# Altium schematic sheet DIY-USB Led Controller.SchDoc
size A; DocumentNumber: 1; SheetNumber: 1; SheetTotal: 7
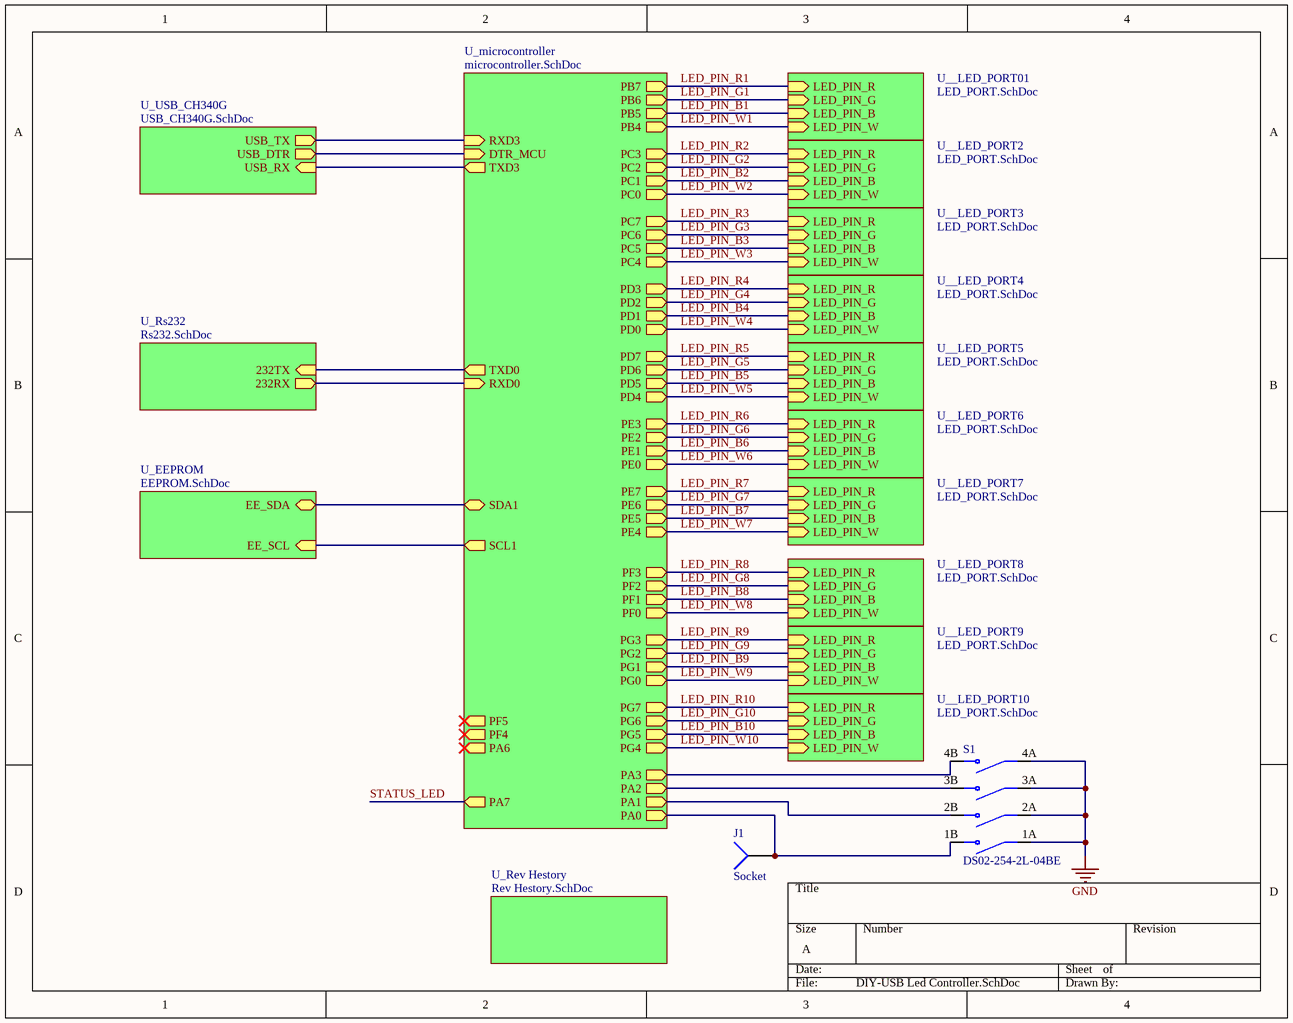
[diagram p0: DIY-USB Led Controller.SchDoc]

## Parts
J1  Socket  [PIN1]
S1  DS02-254-2L-04BE  [SW_DS02-254-2L-04BE]

## Sub-sheets
U__LED_PORT01 = LED_PORT.SchDoc: LED_PIN_R (in), LED_PIN_B (in), LED_PIN_W (in), LED_PIN_G (in)
U__LED_PORT2 = LED_PORT.SchDoc: LED_PIN_R (in), LED_PIN_B (in), LED_PIN_W (in), LED_PIN_G (in)
U__LED_PORT3 = LED_PORT.SchDoc: LED_PIN_R (in), LED_PIN_B (in), LED_PIN_W (in), LED_PIN_G (in)
U__LED_PORT4 = LED_PORT.SchDoc: LED_PIN_R (in), LED_PIN_B (in), LED_PIN_W (in), LED_PIN_G (in)
U__LED_PORT5 = LED_PORT.SchDoc: LED_PIN_R (in), LED_PIN_B (in), LED_PIN_W (in), LED_PIN_G (in)
U__LED_PORT6 = LED_PORT.SchDoc: LED_PIN_R (in), LED_PIN_B (in), LED_PIN_W (in), LED_PIN_G (in)
U__LED_PORT7 = LED_PORT.SchDoc: LED_PIN_R (in), LED_PIN_B (in), LED_PIN_W (in), LED_PIN_G (in)
U__LED_PORT8 = LED_PORT.SchDoc: LED_PIN_R (in), LED_PIN_B (in), LED_PIN_W (in), LED_PIN_G (in)
U__LED_PORT9 = LED_PORT.SchDoc: LED_PIN_R (in), LED_PIN_B (in), LED_PIN_W (in), LED_PIN_G (in)
U__LED_PORT10 = LED_PORT.SchDoc: LED_PIN_R (in), LED_PIN_B (in), LED_PIN_W (in), LED_PIN_G (in)
U_EEPROM = EEPROM.SchDoc: EE_SCL (in), EE_SDA (bidir)
U_microcontroller = microcontroller.SchDoc: PC0 (out), PC1 (out), PC2 (out), PC3 (out), PC4 (out), PC5 (out), PC6 (out), PC7 (out), PE0 (out), PE1 (out), PE2 (out), PE3 (out), PE4 (out), PE5 (out), PE6 (out), PE7 (out), PG0 (out), PG1 (out), PG2 (out), PG3 (out), PG4 (out), PG5 (out), PG6 (out), PG7 (out), PB7 (out), PB6 (out), PB5 (out), PB4 (out), SCL1 (out), SDA1 (bidir), RXD3 (in), TXD3 (out), PD7 (out), PD6 (out), PD5 (out), PD4 (out), PD3 (out), PD2 (out), PD1 (out), PD0 (out), TXD0 (out), RXD0 (in), DTR_MCU (in), PF5 (out), PF4 (out), PF3 (out), PF2 (out), PF1 (out), PF0 (out), PA1 (out), PA3 (out), PA2 (out), PA0 (out), PA7 (out), PA6 (out)
U_Rev Hestory = Rev Hestory.SchDoc: no entries
U_Rs232 = Rs232.SchDoc: 232TX (in), 232RX (out)
U_USB_CH340G = USB_CH340G.SchDoc: USB_TX (out), USB_RX (in), USB_DTR (out)

## Nets
GND: S1.1A(COM1) S1.2A(COM2) S1.3A(COM3) S1.4A(COM4)
LED_PIN_B1: sheet U_microcontroller/PB5, sheet U__LED_PORT01/LED_PIN_B
LED_PIN_B2: sheet U_microcontroller/PC1, sheet U__LED_PORT2/LED_PIN_B
LED_PIN_B3: sheet U_microcontroller/PC5, sheet U__LED_PORT3/LED_PIN_B
LED_PIN_B4: sheet U_microcontroller/PD1, sheet U__LED_PORT4/LED_PIN_B
LED_PIN_B5: sheet U_microcontroller/PD5, sheet U__LED_PORT5/LED_PIN_B
LED_PIN_B6: sheet U_microcontroller/PE1, sheet U__LED_PORT6/LED_PIN_B
LED_PIN_B7: sheet U_microcontroller/PE5, sheet U__LED_PORT7/LED_PIN_B
LED_PIN_B8: sheet U_microcontroller/PF1, sheet U__LED_PORT8/LED_PIN_B
LED_PIN_B9: sheet U_microcontroller/PG1, sheet U__LED_PORT9/LED_PIN_B
LED_PIN_B10: sheet U_microcontroller/PG5, sheet U__LED_PORT10/LED_PIN_B
LED_PIN_G1: sheet U_microcontroller/PB6, sheet U__LED_PORT01/LED_PIN_G
LED_PIN_G2: sheet U_microcontroller/PC2, sheet U__LED_PORT2/LED_PIN_G
LED_PIN_G3: sheet U_microcontroller/PC6, sheet U__LED_PORT3/LED_PIN_G
LED_PIN_G4: sheet U_microcontroller/PD2, sheet U__LED_PORT4/LED_PIN_G
LED_PIN_G5: sheet U_microcontroller/PD6, sheet U__LED_PORT5/LED_PIN_G
LED_PIN_G6: sheet U_microcontroller/PE2, sheet U__LED_PORT6/LED_PIN_G
LED_PIN_G7: sheet U_microcontroller/PE6, sheet U__LED_PORT7/LED_PIN_G
LED_PIN_G8: sheet U_microcontroller/PF2, sheet U__LED_PORT8/LED_PIN_G
LED_PIN_G9: sheet U_microcontroller/PG2, sheet U__LED_PORT9/LED_PIN_G
LED_PIN_G10: sheet U_microcontroller/PG6, sheet U__LED_PORT10/LED_PIN_G
LED_PIN_R1: sheet U_microcontroller/PB7, sheet U__LED_PORT01/LED_PIN_R
LED_PIN_R2: sheet U_microcontroller/PC3, sheet U__LED_PORT2/LED_PIN_R
LED_PIN_R3: sheet U_microcontroller/PC7, sheet U__LED_PORT3/LED_PIN_R
LED_PIN_R4: sheet U_microcontroller/PD3, sheet U__LED_PORT4/LED_PIN_R
LED_PIN_R5: sheet U_microcontroller/PD7, sheet U__LED_PORT5/LED_PIN_R
LED_PIN_R6: sheet U_microcontroller/PE3, sheet U__LED_PORT6/LED_PIN_R
LED_PIN_R7: sheet U_microcontroller/PE7, sheet U__LED_PORT7/LED_PIN_R
LED_PIN_R8: sheet U_microcontroller/PF3, sheet U__LED_PORT8/LED_PIN_R
LED_PIN_R9: sheet U_microcontroller/PG3, sheet U__LED_PORT9/LED_PIN_R
LED_PIN_R10: sheet U_microcontroller/PG7, sheet U__LED_PORT10/LED_PIN_R
LED_PIN_W1: sheet U_microcontroller/PB4, sheet U__LED_PORT01/LED_PIN_W
LED_PIN_W2: sheet U_microcontroller/PC0, sheet U__LED_PORT2/LED_PIN_W
LED_PIN_W3: sheet U_microcontroller/PC4, sheet U__LED_PORT3/LED_PIN_W
LED_PIN_W4: sheet U_microcontroller/PD0, sheet U__LED_PORT4/LED_PIN_W
LED_PIN_W5: sheet U_microcontroller/PD4, sheet U__LED_PORT5/LED_PIN_W
LED_PIN_W6: sheet U_microcontroller/PE0, sheet U__LED_PORT6/LED_PIN_W
LED_PIN_W7: sheet U_microcontroller/PE4, sheet U__LED_PORT7/LED_PIN_W
LED_PIN_W8: sheet U_microcontroller/PF0, sheet U__LED_PORT8/LED_PIN_W
LED_PIN_W9: sheet U_microcontroller/PG0, sheet U__LED_PORT9/LED_PIN_W
LED_PIN_W10: sheet U_microcontroller/PG4, sheet U__LED_PORT10/LED_PIN_W
STATUS_LED: sheet U_microcontroller/PA7
NetJ1_1: J1.1 S1.1B(NO1) ; sheet U_microcontroller/PA0
NetS1_2B: S1.2B(NO2) ; sheet U_microcontroller/PA1
NetS1_3B: S1.3B(NO3) ; sheet U_microcontroller/PA2
NetS1_4B: S1.4B(NO4) ; sheet U_microcontroller/PA3
(unnamed): sheet U_EEPROM/EE_SCL, sheet U_microcontroller/SCL1
(unnamed): sheet U_EEPROM/EE_SDA, sheet U_microcontroller/SDA1
(unnamed): sheet U_Rs232/232TX, sheet U_microcontroller/TXD0
(unnamed): sheet U_Rs232/232RX, sheet U_microcontroller/RXD0
(unnamed): sheet U_USB_CH340G/USB_TX, sheet U_microcontroller/RXD3
(unnamed): sheet U_USB_CH340G/USB_RX, sheet U_microcontroller/TXD3
(unnamed): sheet U_USB_CH340G/USB_DTR, sheet U_microcontroller/DTR_MCU

## Library data of the parts
S1 = DS02-254-2L-04BE: Dip Switch SPST 4 Position Through Hole, Right Angle Piano Actuator 25mA 24VDC; Package: None; Price: None; Value: *; MP: DS02-254-2L-04BE; Availability: Unavailable
J1 = Socket: LatestRevisionDate: 17-Jul-2002; LatestRevisionNote: Re-released for DXP Platform.; Publisher: Altium Limited